# Altium schematic sheet AnalogConnectors.SchDoc: Analog RJ45 Connectors
size Letter; Engineer: Nathan Petersen; DocumentNumber: 7; Revision: v1.2; SheetNumber: 7; SheetTotal: 23
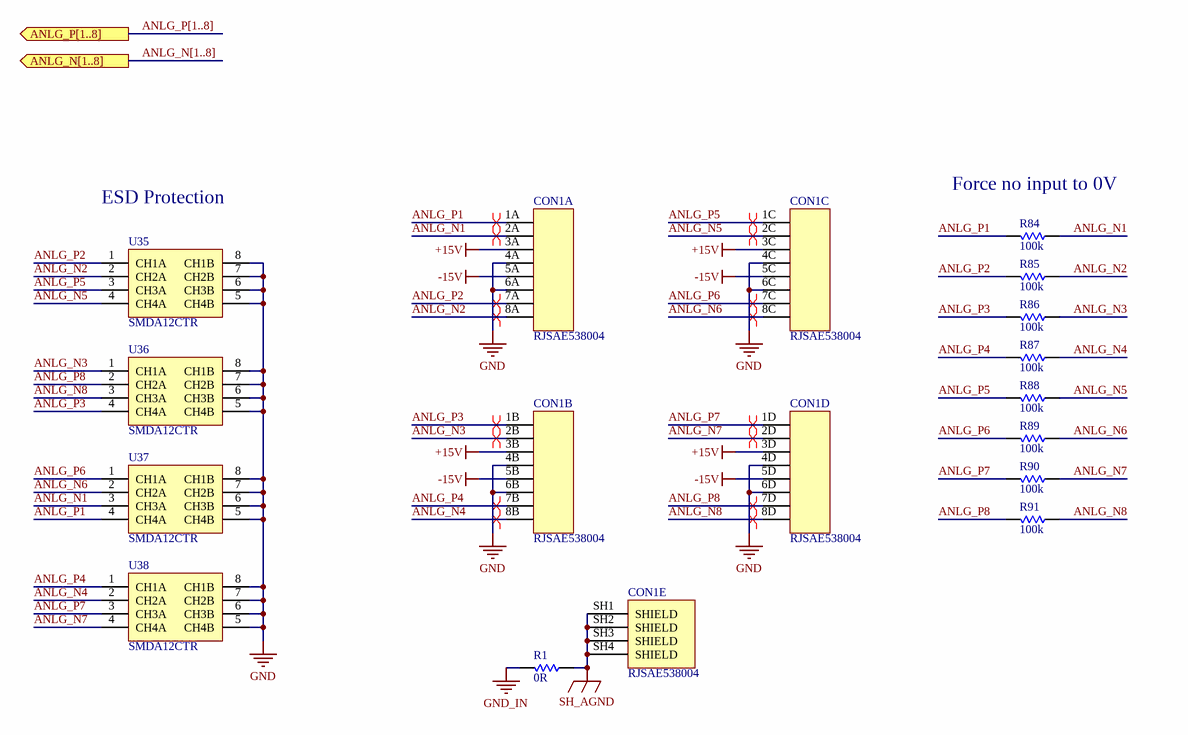
[diagram p0: AnalogConnectors.SchDoc]

## Parts
CON1  RJSAE538004  [RJSAE538004]  (parts A,B,C,D,E of 5)
R1  value 0R  [1206-RES]  (hidden comment: Resistor)
R84  value 100k  [0603-RES]  (hidden comment: Resistor)
R85  value 100k  [0603-RES]  (hidden comment: Resistor)
R86  value 100k  [0603-RES]  (hidden comment: Resistor)
R87  value 100k  [0603-RES]  (hidden comment: Resistor)
R88  value 100k  [0603-RES]  (hidden comment: Resistor)
R89  value 100k  [0603-RES]  (hidden comment: Resistor)
R90  value 100k  [0603-RES]  (hidden comment: Resistor)
R91  value 100k  [0603-RES]  (hidden comment: Resistor)
U35  SMDA12CTR  [SOIC127P600X175-8N]
U36  SMDA12CTR  [SOIC127P600X175-8N]
U37  SMDA12CTR  [SOIC127P600X175-8N]
U38  SMDA12CTR  [SOIC127P600X175-8N]

## Ports
ANLG_N[1..8] (out), ANLG_P[1..8] (out)

## Nets
+15V: CON1.3A CON1.3B CON1.3C CON1.3D
-15V: CON1.5A CON1.5B CON1.5C CON1.5D
GND: CON1.4A CON1.4B CON1.4C CON1.4D CON1.6A CON1.6B CON1.6C CON1.6D U35.5(CH4B) U35.6(CH3B) U35.7(CH2B) U35.8(CH1B) U36.5(CH4B) U36.6(CH3B) U36.7(CH2B) U36.8(CH1B) U37.5(CH4B) U37.6(CH3B) U37.7(CH2B) U37.8(CH1B) U38.5(CH4B) U38.6(CH3B) U38.7(CH2B) U38.8(CH1B)
GND_IN: R1.2
SH_AGND: CON1.SH1(SHIELD) CON1.SH2(SHIELD) CON1.SH3(SHIELD) CON1.SH4(SHIELD) R1.1
ANLG_N1: CON1.2A R84.1 U37.3(CH3A)
ANLG_N2: CON1.8A R85.1 U35.2(CH2A)
ANLG_N3: CON1.2B R86.1 U36.1(CH1A)
ANLG_N4: CON1.8B R87.1 U38.2(CH2A)
ANLG_N5: CON1.2C R88.1 U35.4(CH4A)
ANLG_N6: CON1.8C R89.1 U37.2(CH2A)
ANLG_N7: CON1.2D R90.1 U38.4(CH4A)
ANLG_N8: CON1.8D R91.1 U36.3(CH3A)
ANLG_P1: CON1.1A R84.2 U37.4(CH4A)
ANLG_P2: CON1.7A R85.2 U35.1(CH1A)
ANLG_P3: CON1.1B R86.2 U36.4(CH4A)
ANLG_P4: CON1.7B R87.2 U38.1(CH1A)
ANLG_P5: CON1.1C R88.2 U35.3(CH3A)
ANLG_P6: CON1.7C R89.2 U37.1(CH1A)
ANLG_P7: CON1.1D R90.2 U38.3(CH3A)
ANLG_P8: CON1.7D R91.2 U36.2(CH2A)

## Buses and harness runs
bus ANLG_N[1..8] = port ANLG_N[1..8]
bus ANLG_P[1..8] = port ANLG_P[1..8]

## Layout directives
differential pair: ANLG_N1, ANLG_N2, ANLG_N3, ANLG_N4, ANLG_N5, ANLG_N6, ANLG_N7, ANLG_N8, ANLG_P1, ANLG_P2, ANLG_P3, ANLG_P4, ANLG_P5, ANLG_P6, ANLG_P7, ANLG_P8

## Notes on the sheet
- ESD Protection
- (near R84) Force no input to 0V
- Title:
- File:
- Sheet:
- of
- Revision:
- Time:
- Date:
- Engineer:

## Library data of the parts
CON1 = RJSAE538004: CONN MOD JACK 8P8C R/A SHIELDED; Supplier 1: Digi-Key; Supplier Part Number 1: RJSAE538004-ND
U35-U38 = SMDA12CTR: TVS DIODE 12V 19V 8SO; Supplier 1: Digi-Key; Supplier Part Number 1: 1655-1701-1-ND
R1 R84-R91 = Resistor: Supplier 1: Digi-Key
  R1: Supplier Part Number 1: 311-0.0ERCT-ND
  R84-R91: Supplier Part Number 1: 311-100KLDCT-ND